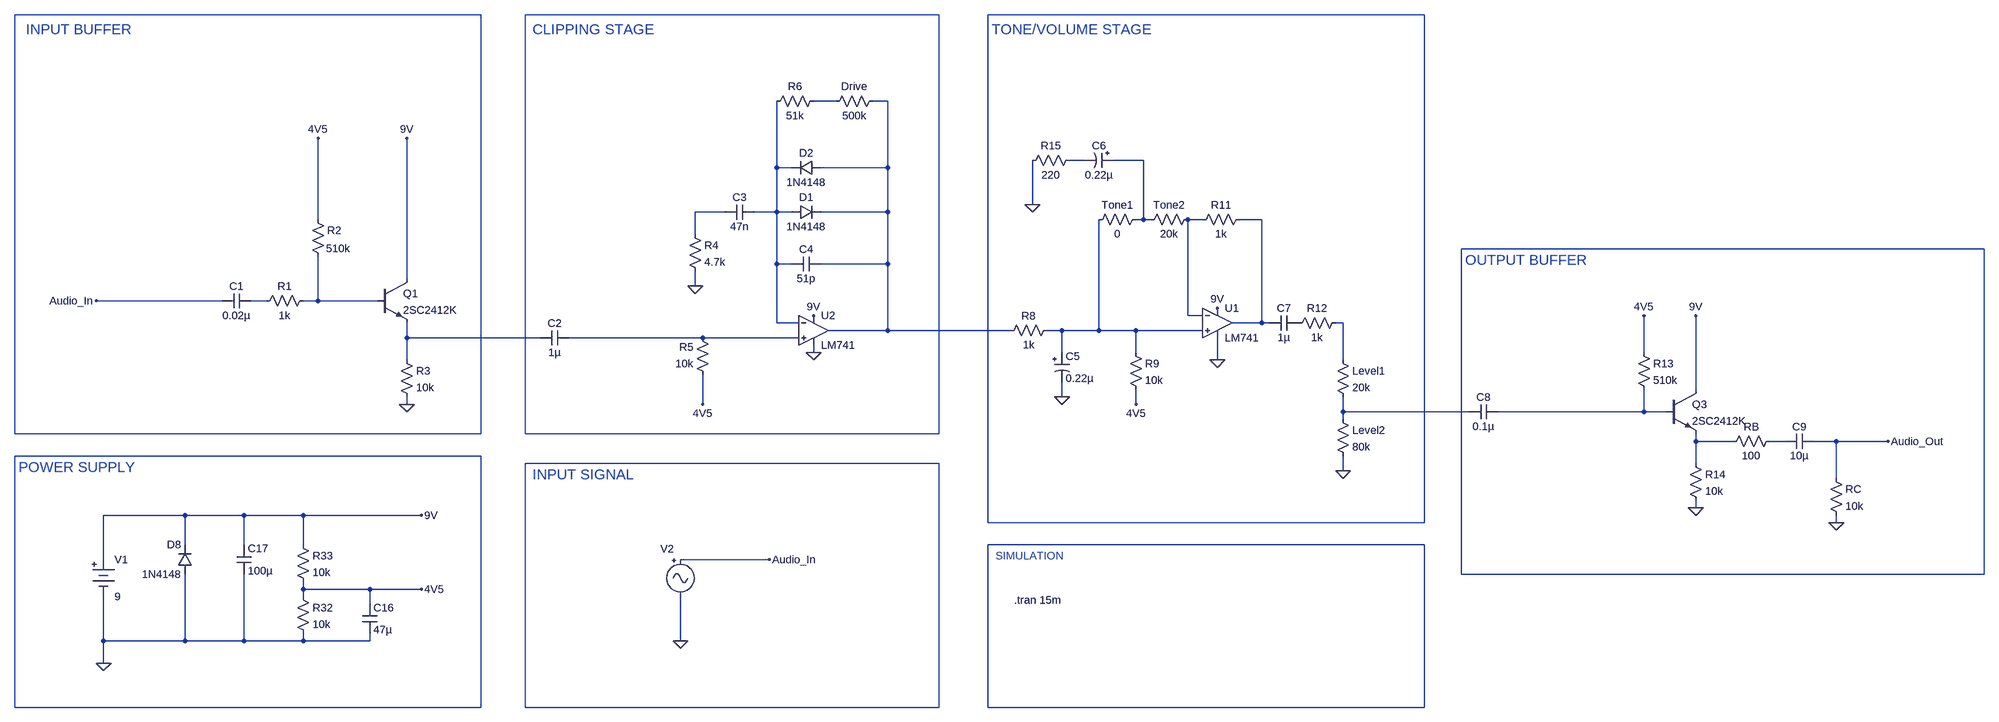
[diagram p0: schematic pedale_non_finito.asc]
pedale_non_finito.asc, the LTspice schematic file:
Version 4
SHEET 1 3684 1220
WIRE 336 -288 -672 -288
WIRE 1392 -288 432 -288
WIRE 2464 -288 1520 -288
WIRE 1104 -96 1056 -96
WIRE 1216 -96 1184 -96
WIRE 1728 32 1696 32
WIRE 1856 32 1792 32
WIRE 976 48 976 -96
WIRE 1008 48 976 48
WIRE 1216 48 1216 -96
WIRE 1216 48 1072 48
WIRE 1616 128 1616 32
WIRE 864 144 800 144
WIRE 976 144 976 48
WIRE 976 144 928 144
WIRE 1008 144 976 144
WIRE 1216 144 1216 48
WIRE 1216 144 1072 144
WIRE -16 160 -16 -16
WIRE 1856 160 1856 32
WIRE 1856 160 1840 160
WIRE 1872 160 1856 160
WIRE 1984 160 1952 160
WIRE 2112 160 2064 160
WIRE 800 192 800 144
WIRE 3680 224 2544 224
WIRE 976 256 976 144
WIRE 1008 256 976 256
WIRE 1216 256 1216 144
WIRE 1216 256 1072 256
WIRE 176 288 176 -16
WIRE 800 304 800 272
WIRE -224 336 -496 336
WIRE -128 336 -160 336
WIRE -16 336 -16 240
WIRE -16 336 -48 336
WIRE 112 336 -16 336
WIRE 1952 368 1952 160
WIRE 1984 368 1952 368
WIRE 976 384 976 256
WIRE 1024 384 976 384
WIRE 2112 384 2112 160
WIRE 2112 384 2048 384
WIRE 2128 384 2112 384
WIRE 2288 384 2272 384
WIRE 1216 400 1216 256
WIRE 1216 400 1088 400
WIRE 1568 400 1216 400
WIRE 1680 400 1648 400
WIRE 1760 400 1760 160
WIRE 1760 400 1680 400
WIRE 1840 400 1760 400
WIRE 1984 400 1840 400
WIRE 176 416 176 384
WIRE 464 416 176 416
WIRE 816 416 528 416
WIRE 1024 416 816 416
WIRE 1056 448 1056 432
WIRE 1680 448 1680 400
WIRE 1840 448 1840 400
WIRE 2944 448 2944 368
WIRE 176 464 176 416
WIRE 2016 464 2016 416
WIRE 2288 464 2288 384
WIRE 3056 528 3056 368
WIRE 1680 544 1680 512
WIRE 176 560 176 544
WIRE 816 560 816 496
WIRE 1840 560 1840 528
WIRE 2288 576 2288 544
WIRE 2560 576 2288 576
WIRE 2944 576 2944 528
WIRE 2944 576 2624 576
WIRE 2992 576 2944 576
WIRE 2288 592 2288 576
WIRE -672 624 -672 -288
WIRE 336 624 336 -288
WIRE 336 624 -672 624
WIRE 432 624 432 -288
WIRE 1392 624 1392 -288
WIRE 1392 624 432 624
WIRE 3056 640 3056 624
WIRE 3136 640 3056 640
WIRE 3248 640 3216 640
WIRE 3360 640 3312 640
WIRE 3472 640 3360 640
WIRE 336 672 -672 672
WIRE 1392 688 432 688
WIRE 3056 688 3056 640
WIRE 2288 704 2288 672
WIRE 3360 720 3360 640
WIRE 3056 784 3056 768
WIRE -304 800 -480 800
WIRE -176 800 -304 800
WIRE -48 800 -176 800
WIRE 208 800 -48 800
WIRE 1520 816 1520 -288
WIRE 2464 816 2464 -288
WIRE 2464 816 1520 816
WIRE 3360 816 3360 800
WIRE -304 864 -304 800
WIRE -176 864 -176 800
WIRE -48 864 -48 800
WIRE 2464 864 1520 864
WIRE -480 896 -480 800
WIRE 960 896 768 896
WIRE 2544 928 2544 224
WIRE 3680 928 3680 224
WIRE 3680 928 2544 928
WIRE -48 960 -48 944
WIRE 96 960 -48 960
WIRE 208 960 96 960
WIRE -48 976 -48 960
WIRE 96 992 96 960
WIRE -480 1072 -480 976
WIRE -304 1072 -304 928
WIRE -304 1072 -480 1072
WIRE -176 1072 -176 928
WIRE -176 1072 -304 1072
WIRE -48 1072 -48 1056
WIRE -48 1072 -176 1072
WIRE 96 1072 96 1056
WIRE 96 1072 -48 1072
WIRE 768 1072 768 976
WIRE -480 1120 -480 1072
WIRE -672 1216 -672 672
WIRE 336 1216 336 672
WIRE 336 1216 -672 1216
WIRE 432 1216 432 688
WIRE 1392 1216 1392 688
WIRE 1392 1216 432 1216
WIRE 1520 1216 1520 864
WIRE 2464 1216 2464 864
WIRE 2464 1216 1520 1216
FLAG 176 560 0
FLAG 1680 544 0
FLAG 3056 784 0
FLAG 3360 816 0
FLAG 800 304 0
FLAG 208 800 9V
FLAG 208 960 4V5
FLAG 768 1072 0
FLAG -480 1120 0
FLAG 176 -16 9V
FLAG -16 -16 4V5
FLAG 816 560 4V5
FLAG 1056 448 0
FLAG 1056 368 9V
FLAG 1840 560 4V5
FLAG 1616 128 0
FLAG 2288 704 0
FLAG 2944 368 4V5
FLAG 3056 368 9V
FLAG 3472 640 Audio_Out
FLAG -496 336 Audio_In
FLAG 960 896 Audio_In
FLAG 2016 352 9V
FLAG 2016 464 0
SYMBOL npn 112 288 R0
SYMATTR InstName Q1
SYMATTR Value 2SC2412K
SYMBOL res -32 144 R0
WINDOW 3 33 79 Left 2
SYMATTR Value 510k
SYMATTR InstName R2
SYMBOL res -32 320 R90
WINDOW 0 0 56 VBottom 2
WINDOW 3 32 56 VTop 2
SYMATTR InstName R1
SYMATTR Value 1k
SYMBOL cap -160 320 R90
WINDOW 0 0 32 VBottom 2
WINDOW 3 32 32 VTop 2
SYMATTR InstName C1
SYMATTR Value 0.02µ
SYMBOL cap 528 400 R90
WINDOW 0 0 32 VBottom 2
WINDOW 3 32 32 VTop 2
SYMATTR InstName C2
SYMATTR Value 1µ
SYMATTR SpiceLine V=50
SYMBOL cap 1072 240 R90
WINDOW 0 0 32 VBottom 2
WINDOW 3 32 32 VTop 2
SYMATTR InstName C4
SYMATTR Value 51p
SYMBOL diode 1072 32 R90
WINDOW 0 0 32 VBottom 2
WINDOW 3 32 32 VTop 2
SYMATTR InstName D2
SYMATTR Value 1N4148
SYMBOL diode 1008 160 R270
WINDOW 0 32 32 VTop 2
WINDOW 3 0 32 VBottom 2
SYMATTR InstName D1
SYMATTR Value 1N4148
SYMBOL res 1664 384 R90
WINDOW 0 0 56 VBottom 2
WINDOW 3 32 56 VTop 2
SYMATTR InstName R8
SYMATTR Value 1k
SYMBOL res 2080 144 R90
WINDOW 0 0 56 VBottom 2
WINDOW 3 32 56 VTop 2
SYMATTR InstName R11
SYMATTR Value 1k
SYMBOL res 832 512 R180
WINDOW 0 36 76 Left 2
WINDOW 3 36 40 Left 2
SYMATTR InstName R5
SYMATTR Value 10k
SYMBOL res 1072 -112 R90
WINDOW 0 0 56 VBottom 2
WINDOW 3 32 56 VTop 2
SYMATTR InstName R6
SYMATTR Value 51k
SYMBOL cap 928 128 R90
WINDOW 0 0 32 VBottom 2
WINDOW 3 32 32 VTop 2
SYMATTR InstName C3
SYMATTR Value 47n
SYMBOL res 160 448 R0
SYMATTR InstName R3
SYMATTR Value 10k
SYMBOL res 1824 432 R0
SYMATTR InstName R9
SYMATTR Value 10k
SYMBOL res 2928 432 R0
SYMATTR InstName R13
SYMATTR Value 510k
SYMBOL npn 2992 528 R0
SYMATTR InstName Q3
SYMATTR Value 2SC2412K
SYMBOL res 3040 672 R0
SYMATTR InstName R14
SYMATTR Value 10k
SYMBOL res 3232 624 R90
WINDOW 0 0 56 VBottom 2
WINDOW 3 32 56 VTop 2
SYMATTR InstName RB
SYMATTR Value 100
SYMBOL cap 3312 624 R90
WINDOW 0 0 32 VBottom 2
WINDOW 3 32 32 VTop 2
SYMATTR InstName C9
SYMATTR Value 10µ
SYMATTR SpiceLine V=16
SYMBOL res 3344 704 R0
SYMATTR InstName RC
SYMATTR Value 10k
SYMBOL res 784 176 R0
SYMATTR InstName R4
SYMATTR Value 4.7k
SYMBOL res 2288 368 R90
WINDOW 0 0 56 VBottom 2
WINDOW 3 32 56 VTop 2
SYMATTR InstName R12
SYMATTR Value 1k
SYMBOL cap 2192 368 R90
WINDOW 0 0 32 VBottom 2
WINDOW 3 32 32 VTop 2
SYMATTR InstName C7
SYMATTR Value 1µ
SYMATTR SpiceLine V=50
SYMBOL diode -288 928 R180
WINDOW 0 24 64 Left 2
WINDOW 3 24 0 Left 2
SYMATTR InstName D8
SYMATTR Value 1N4148
SYMBOL cap -192 864 R0
SYMATTR InstName C17
SYMATTR Value 100µ
SYMATTR SpiceLine V=10
SYMBOL res -64 848 R0
SYMATTR InstName R33
SYMATTR Value 10k
SYMBOL res -64 960 R0
SYMATTR InstName R32
SYMATTR Value 10k
SYMBOL cap 80 992 R0
SYMATTR InstName C16
SYMATTR Value 47µ
SYMATTR SpiceLine V=10
SYMBOL polcap 1664 448 R0
SYMATTR InstName C5
SYMATTR Value 0.22µ
SYMATTR SpiceLine V=35
SYMBOL Misc\\battery -480 880 R0
WINDOW 123 0 0 Left 0
WINDOW 39 0 0 Left 0
SYMATTR InstName V1
SYMATTR Value 9
SYMBOL Misc\\signal 768 880 R0
WINDOW 0 -43 -7 Left 2
WINDOW 3 -194 96 Invisible 2
WINDOW 123 0 0 Left 0
WINDOW 39 0 0 Left 0
SYMATTR InstName V2
SYMATTR Value SINE(0 0.1 500)
SYMBOL res 1200 -112 R90
WINDOW 0 0 56 VBottom 2
WINDOW 3 32 56 VTop 2
SYMATTR InstName Drive
SYMATTR Value 500k
SYMBOL LM741 1056 336 R0
SYMATTR InstName U2
SYMBOL LM741 2016 320 R0
SYMATTR InstName U1
SYMBOL res 1968 144 R90
WINDOW 0 0 56 VBottom 2
WINDOW 3 32 56 VTop 2
SYMATTR InstName Tone2
SYMATTR Value 20k
SYMBOL res 1856 144 R90
WINDOW 0 0 56 VBottom 2
WINDOW 3 32 56 VTop 2
SYMATTR InstName Tone1
SYMATTR Value 0
SYMBOL polcap 1792 16 R90
WINDOW 0 0 32 VBottom 2
WINDOW 3 32 32 VTop 2
SYMATTR InstName C6
SYMATTR Value 0.22µ
SYMATTR SpiceLine V=35
SYMBOL res 1712 16 R90
WINDOW 0 0 56 VBottom 2
WINDOW 3 32 56 VTop 2
SYMATTR InstName R15
SYMATTR Value 220
SYMBOL res 2272 448 R0
SYMATTR InstName Level1
SYMATTR Value 20k
SYMBOL res 2272 576 R0
SYMATTR InstName Level2
SYMATTR Value 80k
SYMBOL cap 2624 560 R90
WINDOW 0 0 32 VBottom 2
WINDOW 3 32 32 VTop 2
SYMATTR InstName C8
SYMATTR Value 0.1µ
TEXT 1576 984 Left 2 !.tran 15m
TEXT -648 -256 Left 3 ;INPUT BUFFER
TEXT 448 -256 Left 3 ;CLIPPING STAGE
TEXT 1528 -256 Left 3 ;TONE/VOLUME STAGE
TEXT 2552 248 Left 3 ;OUTPUT BUFFER
TEXT -664 696 Left 3 ;POWER SUPPLY
TEXT 448 712 Left 3 ;INPUT SIGNAL
TEXT 1536 888 Left 2 ;SIMULATION

The netlist it stands for:
* pedale_non_finito.asc
Q1 9V N014 N017 0 2SC2412K
R2 4V5 N014 510k
R1 N014 N013 1k
C1 N013 Audio_In 0.02µ
C2 N018 N017 1µ V=50
C4 N005 N008 51p
D2 N005 N008 1N4148
D1 N008 N005 1N4148
R8 N016 N005 1k
R11 N011 N010 1k
R5 4V5 N018 10k
R6 N004 N008 51k
C3 N008 N009 47n
R3 N017 0 10k
R9 N016 4V5 10k
R13 4V5 N020 510k
Q3 9V N020 N021 0 2SC2412K
R14 N021 0 10k
RB N022 N021 100
C9 Audio_Out N022 10µ V=16
RC Audio_Out 0 10k
R4 N009 0 4.7k
R12 N015 P001 1k
C7 P001 N011 1µ V=50
D8 0 9V 1N4148
C17 9V 0 100µ V=10
R33 9V 4V5 10k
R32 4V5 0 10k
C16 4V5 0 47µ V=10
C5 N016 0 0.22µ V=35
V1 9V 0 9
V2 Audio_In 0 SINE(0 0.1 500)
R§Drive N005 N004 500k
XU2 N018 N008 9V 0 N005 LM741  ; pins In+ In- V+ V- OUT
XU1 N016 N010 9V 0 N011 LM741  ; pins In+ In- V+ V- OUT
R§Tone2 N010 N007 20k
R§Tone1 N007 N016 0
C6 N007 N006 0.22µ V=35
R15 N006 0 220
R§Level1 N015 N019 20k
R§Level2 N019 0 80k
C8 N020 N019 0.1µ
.model D D
.lib standard.dio
.model NPN NPN
.model PNP PNP
.lib standard.bjt
.tran 15m
* INPUT BUFFER
* CLIPPING STAGE
* TONE/VOLUME STAGE
* OUTPUT BUFFER
* POWER SUPPLY
* INPUT SIGNAL
* SIMULATION
.lib LM741.lib
.backanno
.end